# EasyEDA Pro project ACDC_双向.eprj, board 三相（SMC）
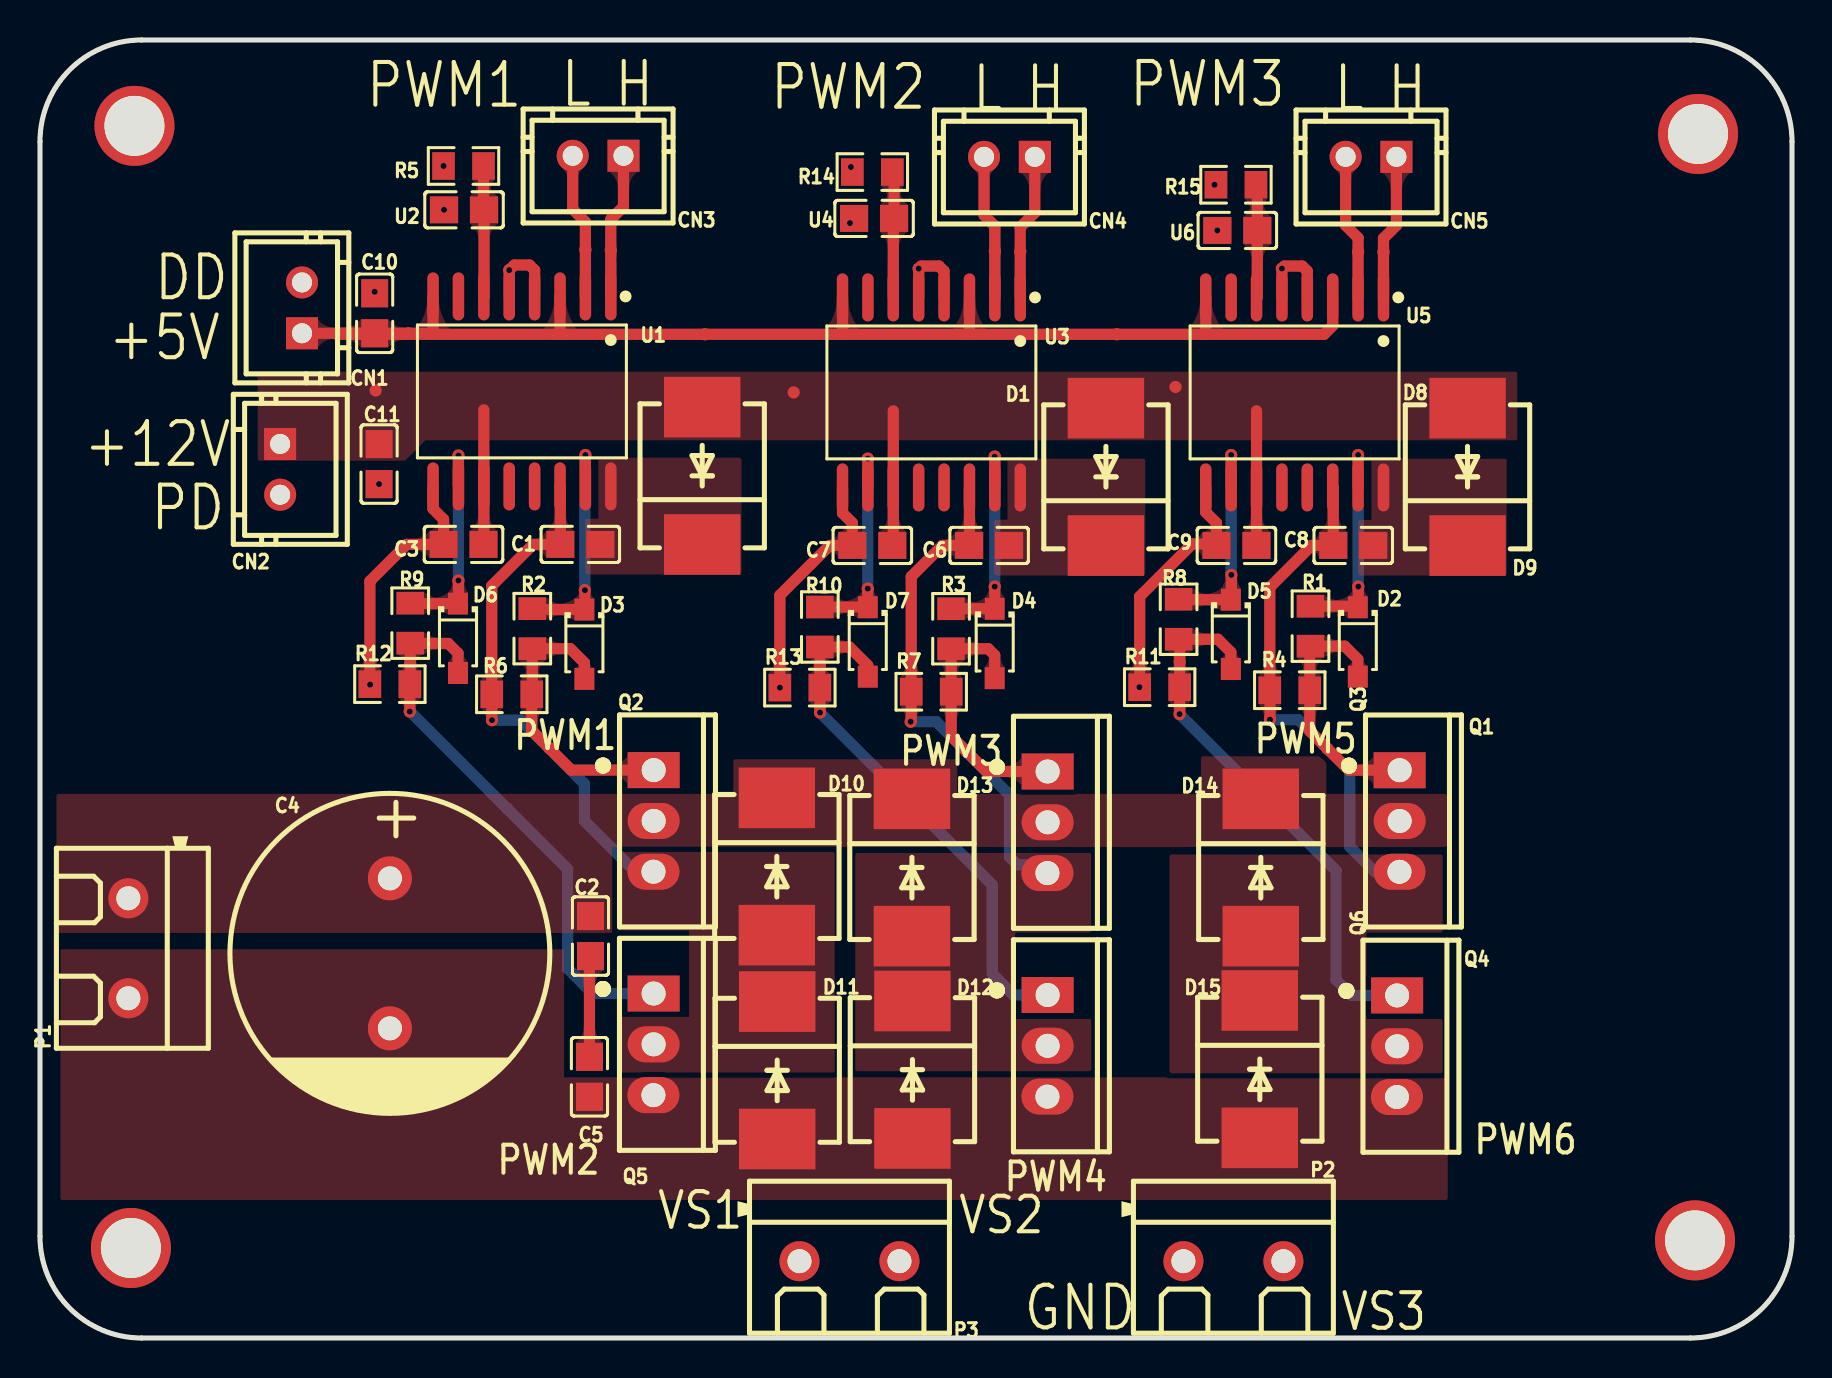
[diagram p7: board, top side]
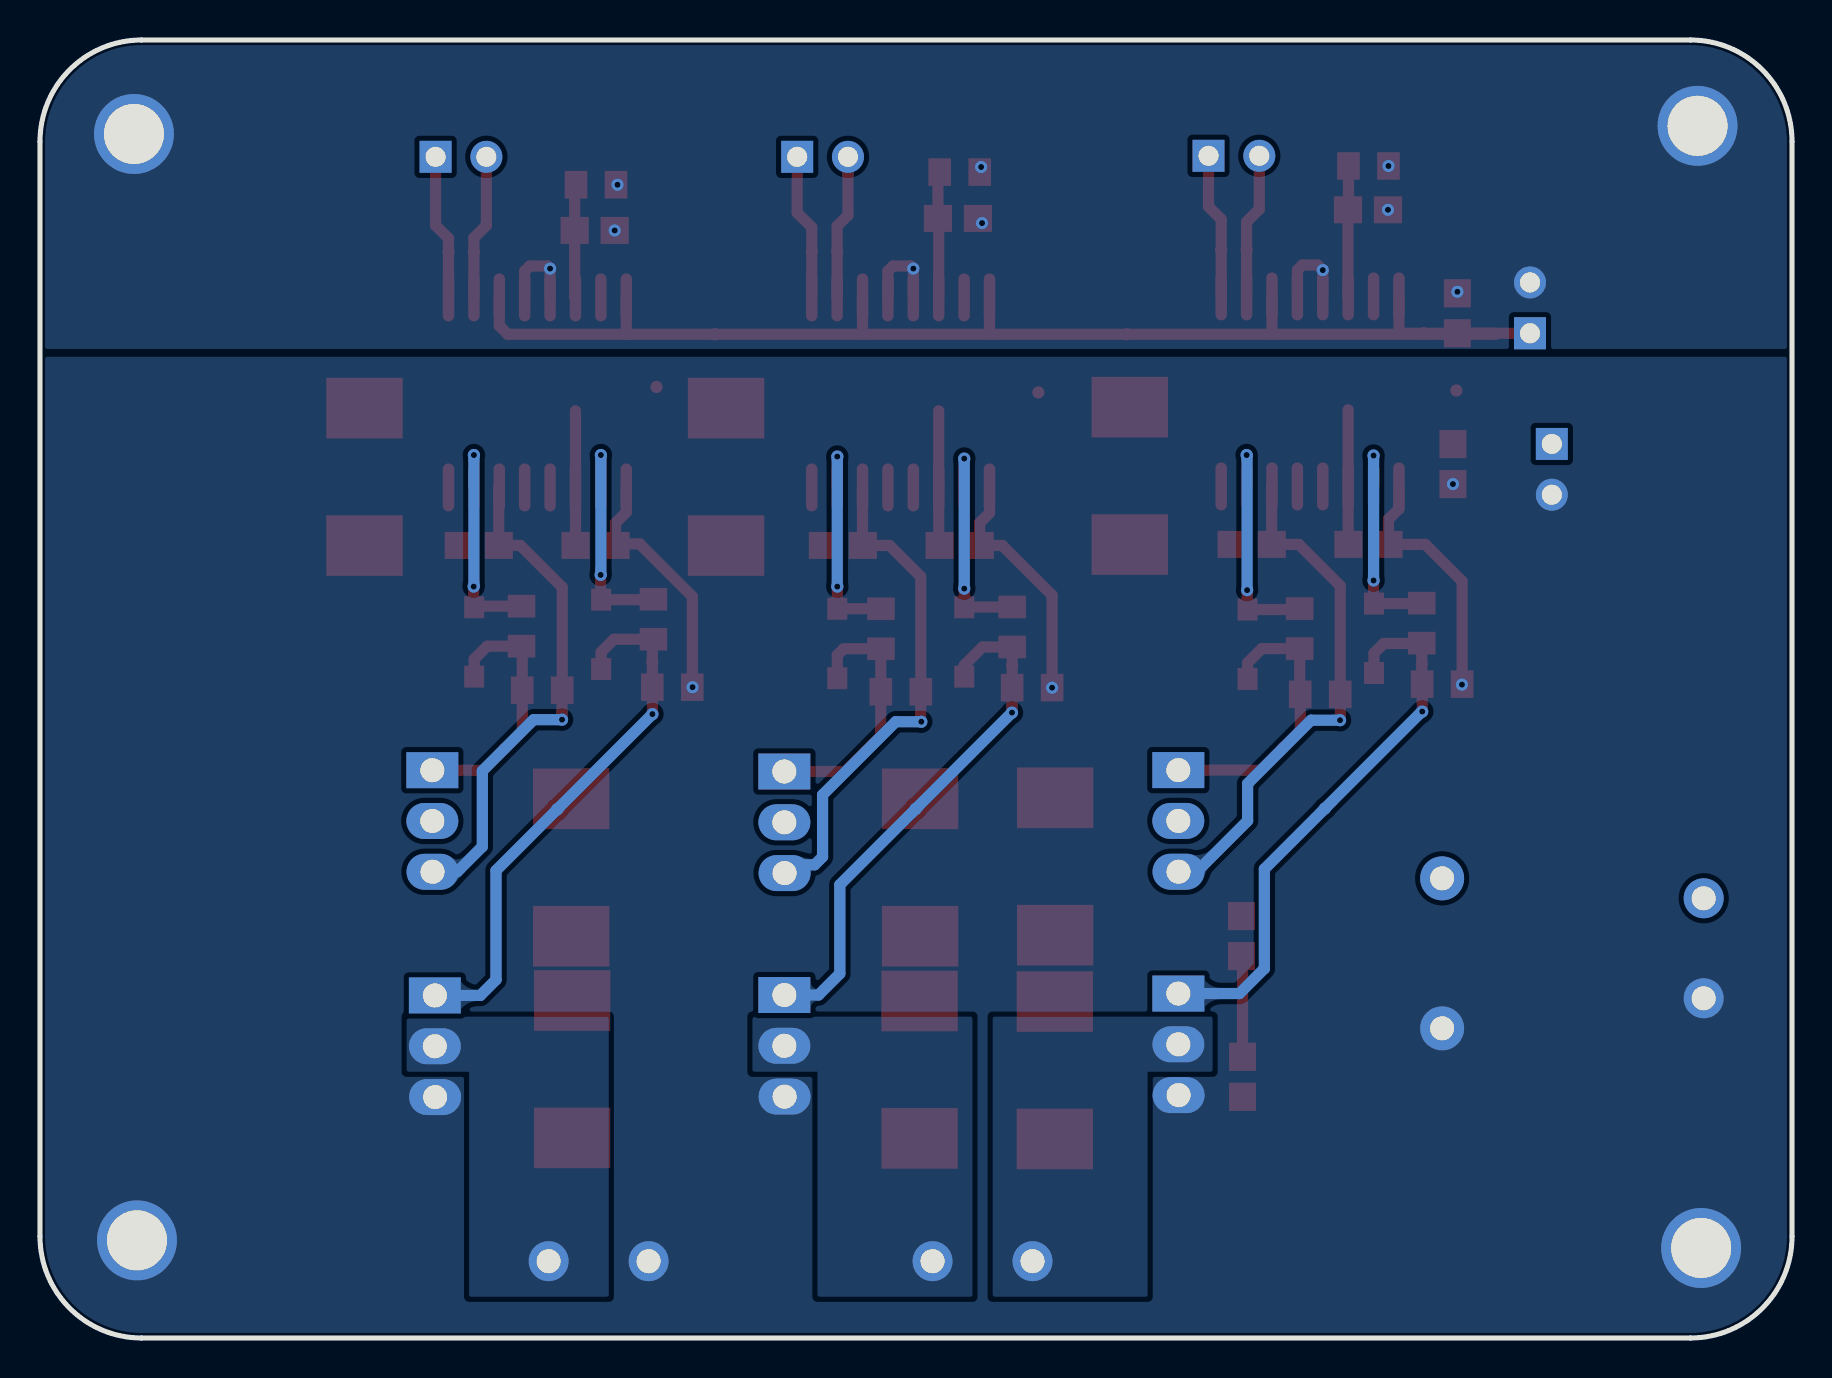
[diagram p8: board, bottom side, seen from below]

Outline 87.63 x 64.9 mm; copper layers: Top Layer, Bottom Layer. Coordinates in mm from the lower left corner of the outline.
Outline path: 0,59.82 0,5.08 arc(1.49,1.49) 5.08,0 82.55,0 arc(86.14,1.49) 87.63,5.08 87.63,59.82 arc(86.14,63.41) 82.55,64.9 5.08,64.9 arc(1.49,63.41) 0,59.82
Stack: Top Layer 0.035mm / Dielectric1 1.51mm FR4 er 4.5 / Bottom Layer 0.035mm

## Design rules (mm)
template: 自定义配置
spacing copperThickness1oz (default): track to track 0.102, other pairs 0.152 to 0.3
spacing copperThickness2oz: track to track 0.203, other pairs 0.152 to 0.3
track width copperThickness1oz (default): min 0.127, default 0.254, max 2.54
track width copperThickness2oz: min 0.203, default 0.254, max 2.54
differential pair differentialPair (default): width min 0.127, default 0.254, max 2.54; gap min 0.152, default 0.152
via viaSize (default): diameter min 0.5, default 0.61, max 10; hole min 0.3, default 0.305, max 6.3

## Placement (name value [footprint] x y rotation side)
C1  1uF  [C0805]  27.03 39.68 0 top
C2  100nF  [C0805]  27.53 20.1 90 top
C3  1uF  [C0805]  21.18 39.68 0 top
C4  470uF  [CAP-TH_BD16.0-P7.50-D1.2-FD]  17.5 19.23 270 top
C5  100nF  [C0805]  27.48 13.06 90 top
C6  1uF  [C0805]  47.47 39.63 0 top
C7  1uF  [C0805]  41.63 39.63 0 top
C8  1uF  [C0805]  65.68 39.63 0 top
C9  1uF  [C0805]  59.84 39.63 0 top
C10  100nF  [C0805]  16.74 51.24 270 top
C11  100nF  [C0805]  16.96 43.7 90 top
CN1  CON2-2.54*2P  [CONN-TH_2P-P2.54-V]  13.11 51.51 90 top
CN2  CON2-2.54*2P  [CONN-TH_2P-P2.54-V]  12.01 43.43 270 top
CN3  CON2-2.54*2P  [CONN-TH_2P-P2.54-V]  27.91 59.11 180 top
CN4  CON2-2.54*2P  [CONN-TH_2P-P2.54-V]  48.49 59.06 180 top
CN5  CON2-2.54*2P  [CONN-TH_2P-P2.54-V]  66.57 59.06 180 top
D1  RS3MC  [SMC_L7.1-W6.2-LS8.1-R-RD]  33.12 43.11 90 top
D2  1N4148W  [SOD-123F_L2.7-W1.6-LS3.8-RD]  65.91 34.8 270 top
D3  1N4148W  [SOD-123F_L2.7-W1.6-LS3.8-RD]  27.23 34.69 270 top
D4  1N4148W  [SOD-123F_L2.7-W1.6-LS3.8-RD]  47.75 34.73 270 top
D5  1N4148W  [SOD-123F_L2.7-W1.6-LS3.8-RD]  59.56 35.18 270 top
D6  1N4148W  [SOD-123F_L2.7-W1.6-LS3.8-RD]  20.91 34.99 270 top
D7  1N4148W  [SOD-123F_L2.7-W1.6-LS3.8-RD]  41.4 34.8 270 top
D8  RS3MC  [SMC_L7.1-W6.2-LS8.1-R-RD]  53.31 43.06 90 top
D9  RS3MC  [SMC_L7.1-W6.2-LS8.1-R-RD]  71.4 43.06 90 top
D10  SK106C  [SMC_L7.1-W6.2-LS8.1-R-RD]  36.86 23.58 270 top
D11  SK106C  [SMC_L7.1-W6.2-LS8.1-R-RD]  36.87 13.39 270 top
D12  SK106C  [SMC_L7.1-W6.2-LS8.1-R-RD]  43.64 13.42 270 top
D13  SK106C  [SMC_L7.1-W6.2-LS8.1-R-RD]  43.61 23.53 270 top
D14  SK106C  [SMC_L7.1-W6.2-LS8.1-R-RD]  61.06 23.53 270 top
D15  SK106C  [SMC_L7.1-W6.2-LS8.1-R-RD]  61.01 13.44 270 top
NOREF  -  [Pad_e190]  25.47 29.5 0 top
NOREF#2  -  [Pad_e232]  57 33.82 0 top
NOREF#3  -  [Pad_e76]  27.28 54.42 0 top
NOREF#4  -  [Pad_e364]  16.79 47.38 0 top
NOREF#5  -  [Pad_e102]  82.78 4.88 0 top
NOREF#6  -  [Pad_e388]  56.79 47.55 0 top
NOREF#7  -  [Pad_e164]  49.03 54.33 0 top
NOREF#8  -  [Pad_e98]  4.72 60.61 0 top
NOREF#9  -  [Pad_e176]  65.93 54.31 0 top
NOREF#10  -  [Pad_e112]  28.55 54.39 0 top
NOREF#11  -  [Pad_e158]  47.76 54.34 0 top
NOREF#12  -  [Pad_e170]  67.2 54.3 0 top
NOREF#13  -  [Pad_e392]  37.7 47.28 0 top
NOREF#14  -  [Pad_e184]  18.52 33.7 0 top
NOREF#15  -  [Pad_e101]  4.55 4.5 0 top
NOREF#16  -  [Pad_e245]  18.42 50.24 0 top
NOREF#17  -  [Pad_e100]  82.93 60.2 0 top
NOREF#18  -  [Pad_e238]  64.39 29.46 0 top
NOREF#19  -  [Pad_e376]  53.87 50.19 0 top
NOREF#20  -  [Pad_e226]  46.32 29.35 0 top
NOREF#21  -  [Pad_e368]  33.26 50.19 0 top
NOREF#22  -  [Pad_e198]  39.01 33.61 0 top
NOREF#23  -  [Pad_e350]  61.76 26.44 0 top
NOREF#24  -  [Pad_e343]  43.84 26.45 0 top
NOREF#25  -  [Pad_e336]  23.37 26.47 0 top
P1  KF301-2P接线端子  [CONN-TH_XY301V-A-5.0-2P]  4.42 19.49 90 top
P2  KF301-2P接线端子  [CONN-TH_XY301V-A-5.0-2P]  59.69 3.84 180 top
P3  KF301-2P接线端子  [CONN-TH_XY301V-A-5.0-2P]  40.49 3.84 180 top
Q1  CSD19536KCS  [TO-220-3_L10.0-W4.5-P2.54-L]  68 25.85 270 top
Q2  CSD19536KCS  [TO-220-3_L10.0-W4.5-P2.54-L]  30.69 25.85 270 top
Q3  CSD19536KCS  [TO-220-3_L10.0-W4.5-P2.54-L]  50.39 25.79 270 top
Q4  CSD19536KCS  [TO-220-3_L10.0-W4.5-P2.54-L]  67.87 14.59 270 top
Q5  CSD19536KCS  [TO-220-3_L10.0-W4.5-P2.54-L]  30.69 14.68 270 top
Q6  CSD19536KCS  [TO-220-3_L10.0-W4.5-P2.54-L]  50.39 14.61 270 top
R1  2Ω  [R0805]  63.55 35.59 270 top
R2  2Ω  [R0805]  24.62 35.47 270 top
R3  2Ω  [R0805]  45.57 35.46 270 top
R4  10kΩ  [R0805]  62.51 32.39 0 top
R5  20kΩ  [R0805]  21.18 58.6 0 top
R6  10kΩ  [R0805]  23.6 32.19 0 top
R7  10kΩ  [R0805]  44.58 32.31 0 top
R8  2Ω  [R0805]  56.95 35.94 270 top
R9  2Ω  [R0805]  18.52 35.74 270 top
R10  2Ω  [R0805]  39.01 35.55 270 top
R11  10kΩ  [R0805]  56 32.54 0 top
R12  10kΩ  [R0805]  17.5 32.69 0 top
R13  10kΩ  [R0805]  38.01 32.52 0 top
R14  20kΩ  [R0805]  41.63 58.3 0 top
R15  20kΩ  [R0805]  59.82 57.67 0 top
U1  UCC21520  [SOIC-16_L10.3-W7.5-P1.27-LS10.3-BL]  24.1 47.33 180 top
U2  100nF  [C0805]  21.21 56.41 0 top
U3  UCC21520  [SOIC-16_L10.3-W7.5-P1.27-LS10.3-BL]  44.58 47.28 180 top
U4  100nF  [C0805]  41.72 55.98 0 top
U5  UCC21520  [SOIC-16_L10.3-W7.5-P1.27-LS10.3-BL]  62.75 47.28 180 top
U6  100nF  [C0805]  59.89 55.38 0 top

## Footprints (pads in the part's own frame, mm; a bottom-side part is the same pattern mirrored in y, then rotated)
C0805
  rect 1.41x1.35 smd: 1(-1,0) 2(1,0)
CAP-TH_BD16.0-P7.50-D1.2-FD
  round 2.2 hole 1.2: 1(-3.75,0) 2(3.75,0)
CONN-TH_2P-P2.54-V
  rect 1.6x1.6 hole 1: 1(-1.27,0)
  round 1.6 hole 1: 2(1.27,0)
CONN-TH_XY301V-A-5.0-2P
  round 2 hole 1.2: 1(-2.5,0) 2(2.5,0)
Pad_e76
  round 0.61 smd: TP1(0,0)
Pad_e98
  round 4 hole 3: 1(0,0)
Pad_e100
  round 4 hole 3: 1(0,0)
Pad_e101
  round 4 hole 3: 1(0,0)
Pad_e102
  round 4 hole 3: 1(0,0)
Pad_e112
  round 0.61 smd: TP2(0,0)
Pad_e158
  round 0.61 smd: TP4(0,0)
Pad_e164
  round 0.61 smd: TP5(0,0)
Pad_e170
  round 0.61 smd: TP6(0,0)
Pad_e176
  round 0.61 smd: TP7(0,0)
Pad_e184
  round 0.61 smd: TP8(0,0)
Pad_e190
  round 0.61 smd: TP9(0,0)
Pad_e198
  round 0.61 smd: TP10(0,0)
Pad_e226
  round 0.61 smd: TP11(0,0)
Pad_e232
  round 0.61 smd: TP12(0,0)
Pad_e238
  round 0.61 smd: TP13(0,0)
Pad_e245
  round 0.61 smd: TP14(0,0)
Pad_e336
  round 0.61 smd far side: TP2(0,0)
Pad_e343
  round 0.61 smd far side: TP3(0,0)
Pad_e350
  round 0.61 smd far side: TP4(0,0)
Pad_e364
  round 0.61 smd: TP5(0,0)
Pad_e368
  round 0.61 smd: TP6(0,0)
Pad_e376
  round 0.61 smd: TP7(0,0)
Pad_e388
  round 0.61 smd: TP8(0,0)
Pad_e392
  round 0.61 smd: TP9(0,0)
R0805
  rect 1.133x1.377 smd: 1(-1,0) 2(1,0)
SMC_L7.1-W6.2-LS8.1-R-RD
  rect 3.03x3.82 smd: 1(3.435,0) 2(-3.435,0)
SOD-123F_L2.7-W1.6-LS3.8-RD
  rect 1.1x1 smd: 1(-1.735,0) 2(1.735,0)
SOIC-16_L10.3-W7.5-P1.27-LS10.3-BL
  oval 0.574x2.401 smd: 1(-4.445,-4.75) 2(-3.175,-4.75) 3(-1.905,-4.75) 4(-0.635,-4.75) 5(0.635,-4.75) 6(1.905,-4.75) 7(3.175,-4.75) 8(4.445,-4.75) 9(4.445,4.75) 10(3.175,4.75) 11(1.905,4.75) 12(0.635,4.75) 13(-0.635,4.75) 14(-1.905,4.75) 15(-3.175,4.75) 16(-4.445,4.75)
TO-220-3_L10.0-W4.5-P2.54-L
  rect 1.8x2.6 hole 1.2: 1(-2.54,0.005)
  oval 1.8x2.6 hole 1.2: 2(0,0.005) 3(2.54,-0.005)

## Nets
+5V: C10.2 CN1.1 NOREF#16.TP14 NOREF#19.TP7 NOREF#21.TP6 U1.3 U1.8 U3.3 U3.8 U5.3 U5.8
+12V: C3.2 C7.2 C9.2 C11.2 CN2.1 D1.1 D8.1 D9.1 NOREF#4.TP5 NOREF#6.TP8 NOREF#13.TP9 U1.11 U3.11 U5.11
+VIN: C2.2 C4.1 D10.2 D13.2 D14.2 P1.2 Q1.2 Q2.2 Q3.2
DGND: C10.1 CN1.2 NOREF#8.1 NOREF#17.1 R5.1 R14.1 R15.1 U1.4 U1.5 U2.1 U3.4 U3.5 U4.1 U5.4 U5.5 U6.1
PGND: C3.1 C4.2 C5.1 C7.1 C9.1 C11.1 CN2.2 D11.1 D12.1 D15.1 NOREF#5.1 NOREF#15.1 P1.1 P2.2 Q4.3 Q5.3 Q6.3 R11.1 R12.1 R13.1 U1.9 U3.9 U5.9
H1: D3.1 R2.1 U1.15
H2: D4.1 R3.1 U3.15
H3: D2.1 R1.1 U5.15
L1: D6.1 R9.1 U1.10
L2: D7.1 R10.1 U3.10
L3: D5.1 R8.1 U5.10
PWMH1: CN3.1 NOREF#10.TP2 U1.1
PWMH2: CN4.1 NOREF#7.TP5 U3.1
PWMH3: CN5.1 NOREF#12.TP6 U5.1
PWML1: CN3.2 NOREF#3.TP1 U1.2
PWML2: CN4.2 NOREF#11.TP4 U3.2
PWML3: CN5.2 NOREF#9.TP7 U5.2
VS1: C1.1 D10.1 D11.2 P3.2 Q2.3 Q5.2 R6.1 U1.14
VS2: C6.1 D12.2 D13.1 P3.1 Q3.3 Q6.2 R7.1 U3.14
VS3: C8.1 D14.1 D15.2 P2.1 Q1.3 Q4.2 R4.1 U5.14
$1N1727: D6.2 NOREF#14.TP8 NOREF#25.TP2 Q5.1 R9.2 R12.2
$1N1729: D3.2 NOREF.TP9 Q2.1 R2.2 R6.2
$1N1731: D4.2 NOREF#20.TP11 Q3.1 R3.2 R7.2
$1N1733: D7.2 NOREF#22.TP10 NOREF#24.TP3 Q6.1 R10.2 R13.2
$1N1740: R14.2 U3.6 U4.2
$1N1748: R5.2 U1.6 U2.2
$1N1758: C6.2 D8.2 U3.16
$1N1759: C1.2 D1.2 U1.16
$1N1779: C2.1 C5.2
$1N1953: D2.2 NOREF#18.TP13 Q1.1 R1.2 R4.2
$1N2084: D5.2 NOREF#2.TP12 NOREF#23.TP4 Q4.1 R8.2 R11.2
$1N2554: R15.2 U5.6 U6.2
$1N2562: C8.2 D9.2 U5.16

Pads without a net: U1 7 12 13; U3 7 12 13; U5 7 12 13

## Via types
v1: diameter 0.61, hole 0.305, Top Layer to Bottom Layer, 32 vias

## Routing (per net, layer and track width the routed paths; a pad name or vN(x,y) marks a point on that pad's centre or on a via; arc(x,y) is an arc through that point)
+5V: length 69.2
  Top Layer w0.559: 46.4,50.19 46.49,50.27 U3.3 ; 46.4,50.19 40.05,50.19 ; 46.4,50.19 NOREF#19.TP7 58.24,50.19 ; 25.95,50.19 NOREF#21.TP6 40.05,50.19 ; 25.95,50.19 14.85,50.19 14.9,50.24 C10.2 ; 25.95,50.19 26.01,50.24 U1.3 ; U3.8 40.14,50.27 40.05,50.19 ; U1.8 19.66,50.29 19.6,50.24 NOREF#16.TP14 C10.2 ; C10.2 16.74,50.24 13.11,50.24 ; 58.24,50.19 58.31,50.26 U5.8 ; 58.24,50.19 64.23,50.19 64.66,50.62 U5.3
+12V: length 20.2
  Top Layer w0.559: 60.85,46.36 U5.11 60.85,39.63 C9.2 ; 42.68,46.36 U3.11 42.68,39.68 C7.2 ; 22.2,46.41 U1.11 22.2,39.7 C3.2
DGND: length 12.5
  Top Layer w0.559: U3.5 v1(43.95,53.47) 44.08,53.6 44.97,53.6 45.22,53.34 U3.4 ; U1.4 24.74,53.4 24.49,53.65 23.72,53.65 v1(23.47,53.4) U1.5 ; 62.12,52.03 v1(62.12,53.47) 62.24,53.6 63.13,53.6 63.39,53.34 U5.4
  vias: v1(16.74,52.31) v1(20.18,58.6) v1(20.21,56.41) v1(40.51,55.75) v1(40.56,58.55) v1(58.75,57.67) v1(58.89,55.38)
PGND: length 37.9
  Top Layer w0.559: U1.9 19.66,41.46 20.18,40.93 C3.1 18.34,39.68 16.5,37.84 R12.1 ; 58.84,39.7 58.84,40.76 58.31,41.29 U5.9 ; 58.84,39.7 C9.1 ; 58.84,39.7 59.06,39.7 ; 58.84,39.7 57.63,39.7 55,37.08 R11.1 ; R13.1 37.01,37.14 39.5,39.63 C7.1 40.63,40.76 40.14,41.25 U3.9
  vias: v1(16.51,32.67) v1(16.96,42.7) v1(37.01,32.52) v1(54.99,32.54)
H1: length 11.9
  Top Layer w0.559: v1(27.28,44.15) U1.15 ; R2.1 24.67,36.42 D3.1 27.25,36.45 v1(27.25,37.39)
  Bottom Layer w0.559: v1(27.25,37.39) 27.25,44.12 v1(27.28,44.15)
H2: length 11.3
  Top Layer w0.559: U3.15 47.76,44.07 v1(47.75,44.07) ; 47.75,36.46 R3.1 ; v1(47.75,37.57) 47.75,36.47
  Bottom Layer w0.559: v1(47.75,44.07) v1(47.75,37.57)
H3: length 11.6
  Top Layer w0.559: D2.1 65.86,36.59 65.81,36.59 ; R1.1 65.81,36.59 ; 65.81,36.59 65.94,36.72 v1(65.94,37.57) ; U5.15 v1(65.93,44.15)
  Bottom Layer w0.559: v1(65.93,44.15) 65.93,37.58 v1(65.94,37.57)
L1: length 11.4
  Top Layer w0.559: U1.10 v1(20.93,44.12) ; R9.1 18.54,36.72 D6.1 20.93,36.74 v1(20.93,37.88)
  Bottom Layer w0.559: v1(20.93,44.12) v1(20.93,37.88)
L2: length 11.3
  Top Layer w0.559: R10.1 41.39,36.55 D7.1 v1(41.4,37.47) ; v1(41.4,43.97) 41.41,43.97 U3.10
  Bottom Layer w0.559: v1(41.4,37.47) v1(41.4,43.97)
L3: length 11.5
  Top Layer w0.559: v1(59.59,38.16) 59.59,36.94 D5.1 56.97,36.92 R8.1 ; U5.10 v1(59.58,44.15)
  Bottom Layer w0.559: v1(59.58,44.15) 59.58,38.17 v1(59.59,38.16)
PWMH1: length 7.3
  Top Layer w0.559: U1.1 NOREF#10.TP2 28.55,55.94 29.18,56.57 CN3.1
PWMH2: length 7.3
  Top Layer w0.559: CN4.1 49.76,56.27 49.03,55.54 NOREF#7.TP5 U3.1
PWMH3: length 7.3
  Top Layer w0.559: CN5.1 67.84,55.63 67.2,54.98 NOREF#12.TP6 U5.1
PWML1: length 7.3
  Top Layer w0.559: U1.2 NOREF#3.TP1 27.28,55.81 26.64,56.44 CN3.2
PWML2: length 7.3
  Top Layer w0.559: U3.2 NOREF#11.TP4 47.76,55.6 47.22,56.14 CN4.2
PWML3: length 7.3
  Top Layer w0.559: CN5.2 65.3,55.63 65.93,55.01 NOREF#9.TP7 U5.2
VS1: length 26.2
  Top Layer w0.559: v1(22.61,30.89) 22.6,30.9 R6.1 22.6,37.61 24.66,39.68 C1.1 26.03,42.56 U1.14
  Bottom Layer w0.559: Q2.3 29.78,23.31 27.23,25.86 27.23,27.72 24.05,30.89 v1(22.61,30.89)
VS2: length 25.8
  Top Layer w0.559: v1(43.55,30.81) 43.58,30.84 R7.1 43.58,38.07 45.14,39.63 C6.1 46.76,39.63 ; U3.14 46.49,39.65
  Bottom Layer w0.559: v1(43.55,30.81) 44.83,30.81 48.49,27.16 48.49,24.06 48.88,23.66 49.97,23.66 Q3.3
VS3: length 25.4
  Top Layer w0.559: v1(61.52,30.92) 61.52,32.38 R4.1 61.51,37.54 63.6,39.63 C8.1 64.68,42.5 U5.14
  Bottom Layer w0.559: Q1.3 66.76,23.31 65.51,24.57 65.51,28.35 62.94,30.92 v1(61.52,30.92)
$1N1727: length 28
  Top Layer w0.559: D6.2 20.91,34.24 20.42,34.73 18.53,34.73 R9.2 NOREF#14.TP8 18.52,32.71 R12.2 18.5,31.33 v1(18.5,31.32)
  Bottom Layer w0.559: v1(18.5,31.32) 18.52,31.32 NOREF#25.TP2 26.39,23.45 26.39,18.47 27.64,17.22 Q5.1
$1N1729: length 14.7
  Top Layer w0.559: 30.69,28.4 26.58,28.4 NOREF.TP9 24.6,30.37 R6.2 24.62,32.21 R2.2 26.52,34.47 27.23,33.76 D3.2
$1N1731: length 13.4
  Top Layer w0.559: Q3.1 47.35,28.33 NOREF#20.TP11 45.58,30.09 R7.2 45.58,34.45 R3.2 47.43,34.46 47.75,34.14 D4.2
$1N1733: length 26.5
  Top Layer w0.559: v1(39.01,31.27) 39.01,32.51 R13.2 NOREF#22.TP10 R10.2 40.48,34.55 41.4,33.63 D7.2
  Bottom Layer w0.559: v1(39.01,31.27) NOREF#24.TP3 47.62,22.66 47.62,18.22 48.69,17.15 Q6.1
$1N1740: length 6.3
  Top Layer w0.559: U3.6 42.68,55.94 U4.2 42.72,58.21 R14.2
$1N1748: length 6.5
  Top Layer w0.559: R5.2 22.18,56.44 U2.2 22.21,52.09 U1.6
$1N1779: length 5.1
  Top Layer w0.559: C5.2 27.48,19.05 C2.1
$1N1953: length 13.1
  Top Layer w0.559: D2.2 65.91,33.94 65.26,34.59 R1.2 63.51,34.55 R4.2 63.51,30.35 NOREF#18.TP13 65.47,28.39 Q1.1
$1N2084: length 27.4
  Top Layer w0.559: D5.2 59.56,34.3 58.92,34.94 R8.2 57,34.89 NOREF#2.TP12 R11.2 57,31.2 v1(57,31.2)
  Bottom Layer w0.559: 67.88,17.13 65.6,17.13 64.82,17.91 64.82,23.37 NOREF#23.TP4 v1(57,31.2)
$1N2554: length 5.7
  Top Layer w0.559: U5.6 60.89,52.07 U6.2 60.89,57.6 R15.2

## Copper pours and planes (outline as drawn; the poured copper is in the pictures)
+12V on Top Layer: 10.9,43.87 18.26,43.87 19.28,44.89 73.89,44.89 73.89,48.32 10.89,48.32 10.89,43.88
+VIN on Top Layer: 0.82,27.21 34.67,27.21 34.67,28.94 45.87,28.94 45.87,27.21 58.06,27.21 58.06,29.09 64.34,29.09 64.34,27.21 70.36,27.21 70.36,24.55 28.63,24.55 28.63,20.25 0.82,20.25
DGND on Bottom Layer: -0.43,64.9 88.59,64.9 88.59,49.45 -0.43,49.45
PGND on Top Layer: 26.21,13.03 70.41,13.03 70.41,6.9 1.02,6.9 1.02,19.44 26.21,19.44
PGND on Bottom Layer: -0.51,49.06 88.2,49.06 88.2,0 -0.51,0
VS1 on Top Layer: 29.01,24.31 39.75,24.31 39.75,13.27 29.01,13.27 29.01,16.06 32.46,16.06 32.46,20.38 29.01,20.38
VS1 on Bottom Layer: 28.98,16.07 39.98,16.07 39.98,2.06 32.23,2.06 32.23,13.31 28.98,13.31
VS2 on Top Layer: 52.58,24.25 40.77,24.25 40.77,13.34 52.58,13.34 52.58,15.95 48.77,15.95 48.77,20.22 48.83,20.27 52.58,20.27
VS2 on Bottom Layer: 51.99,16.07 40.99,16.07 40.99,2.06 48.74,2.06 48.74,13.31 51.99,13.31
VS3 on Top Layer: 70.16,24.18 56.5,24.18 56.5,13.24 70.16,13.24 70.16,15.95 66.35,15.95 66.35,20.22 66.4,20.27 70.16,20.27
VS3 on Bottom Layer: 69.29,16.07 59.18,16.07 59.18,2.06 66.17,2.06 66.17,13.31 69.29,13.31
$1N1758 on Top Layer: 48.38,43.97 48.38,40.91 47.73,40.91 47.73,38.13 55.28,38.13 55.28,43.97
$1N1759 on Top Layer: 27.93,44.01 27.93,40.96 27.28,40.96 27.28,38.18 35.08,38.18 35.08,44.02 27.94,44.02
$1N2562 on Top Layer: 66.6,43.96 66.6,40.91 65.94,40.91 65.94,38.12 73.36,38.12 73.36,43.96

Small or netless copper shapes (teardrops, artwork), in the pictures only: 200 on Top Layer, 30 on Bottom Layer

## Text on the board
Top Silkscreen Layer: PWM2 | PWM1 | PWM3 | PWM4 | PWM5 | PWM6 | VS1 | VS2 | VS3 | +12V | +5V | PD | DD | L | H | GND
